# Altium schematic sheet Ohm's Law.SchDoc
size A4
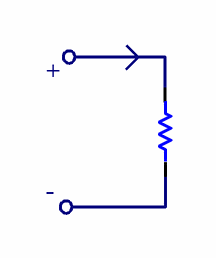
[diagram p0: Ohm's Law.SchDoc]

## Parts
R?  Resistor European Single  [RES 1608[0603] N]  (value not drawn)

## Nets

Not connected (* = marked no-connect by the designer): R? 1 2

## Notes on the sheet
- (near R?) +
- (near R?) -

## Library data of the parts
R? = CMP-00010-A.12: Resistor, 0603, 309kΩ, 1%, 63mW; Case-EIA: 0603; Case-Metric: 1608; Resistance: 10.0kΩ; Power: 100mW; Temp. Coefficient: ±100ppm/°C; Composition: Thick Film; Tolerance: 1%; Max Continuous Current: n/a